# Altium project Carrier-Board-v1.0.PrjPcb (part 5 of 15)

## Sheet USB2.0_INTERFACE.SchDoc
size A4; SheetNumber: 10; SheetTotal: 27
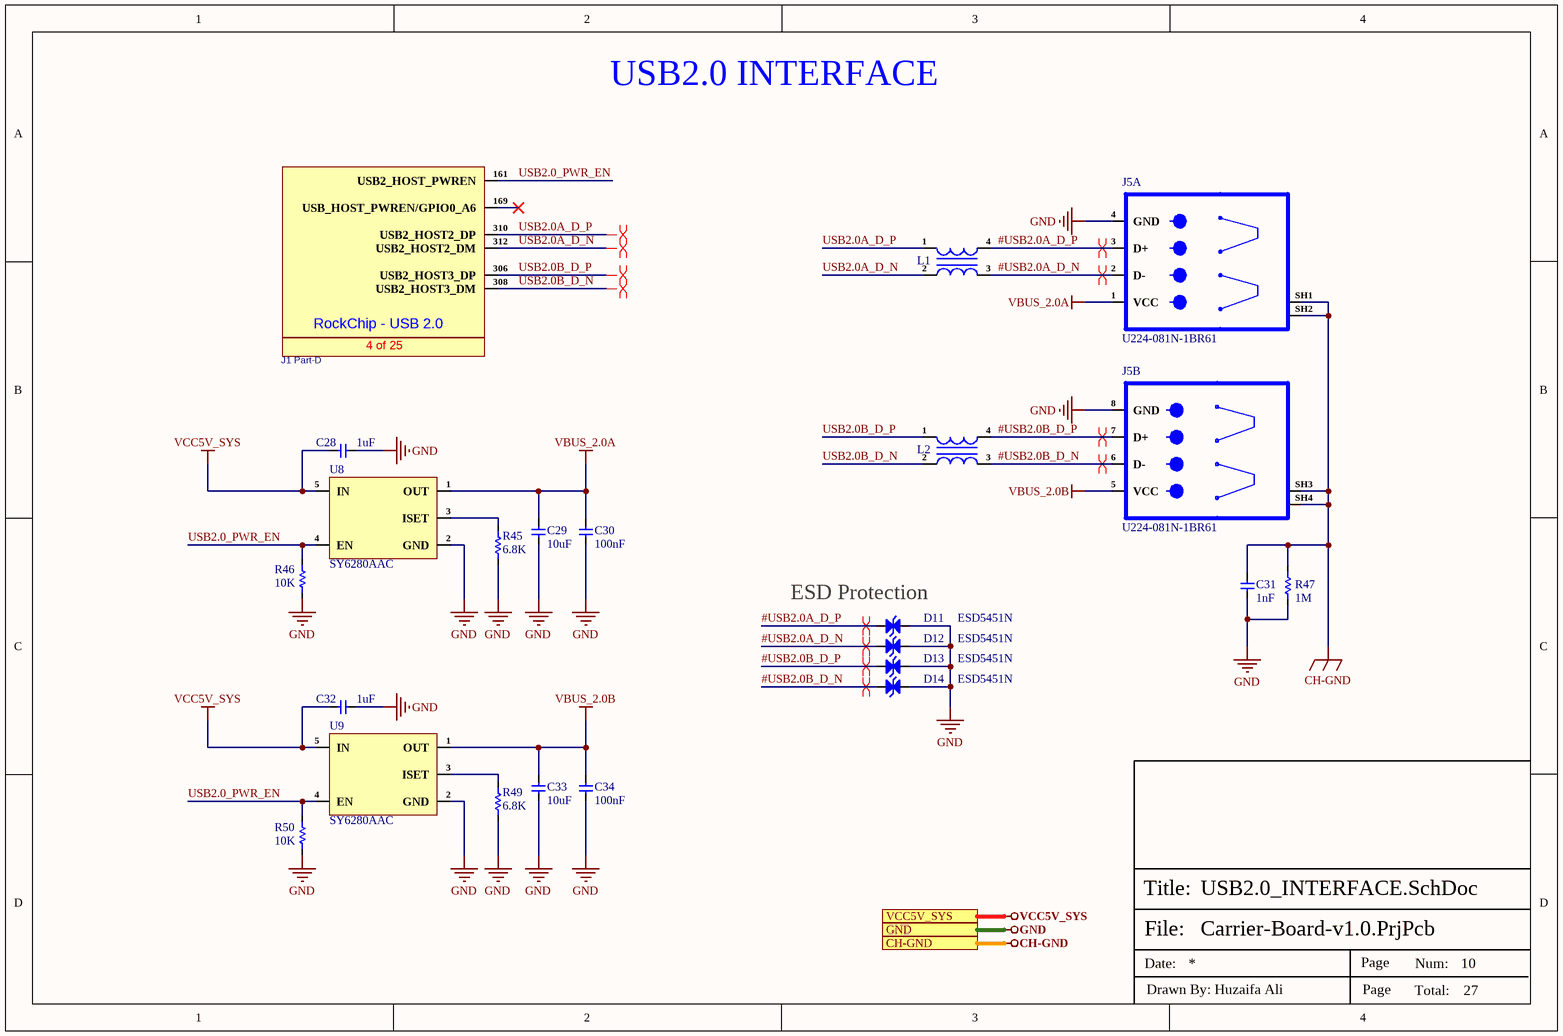
[diagram p9: USB2.0_INTERFACE.SchDoc]

### Parts
C28  1uF  [Cap-0402]
C29  10uF  [Cap-0603]
C30  100nF  [Cap-0402]
C31  1nF  [Cap-1206]
C32  1uF  [Cap-0402]
C33  10uF  [Cap-0603]
C34  100nF  [Cap-0402]
D11  ESD5451N  [DFN1006-2L (Bi-Directional)]
D12  ESD5451N  [DFN1006-2L (Bi-Directional)]
D13  ESD5451N  [DFN1006-2L (Bi-Directional)]
D14  ESD5451N  [DFN1006-2L (Bi-Directional)]
J1_Part-  AS0B826-S78B-7H  [AS0B826-S78B-7H]  (value not drawn)  (part D of 25)
J5  U224-081N-1BR61  [U224-081N-1BR61]  (parts A,B of 2)
L1  MCZ1210CH900L2TA0G  [MCZ1210CH900L2]  (value not drawn)
L2  MCZ1210CH900L2TA0G  [MCZ1210CH900L2]  (value not drawn)
R45  6.8K  [Res-0402]
R46  10K  [Res-0402]
R47  1M  [Res-0402]
R49  6.8K  [Res-0402]
R50  10K  [Res-0402]
U8  SY6280AAC  [SOT-23-5]
U9  SY6280AAC  [SOT-23-5]

### Ports
CH-GND (see TOP SHEET[2C], ETHERNET_PHY0[4D], ETHERNET_PHY1[4D], HDMI_INTERFACE[3D], MICRO_SD_INTERFACE[3D], USB3.0_INTERFACE[3D], USB-C_INTERFACE[2D]), GND (see TOP SHEET[2C], AUDIO_INTERFACE[1D], BUCK REGULATOR[3D], DEBUG_UART_INTERFACE[3D], DIGITAL IO_RELAY_SHEET[5D], DUAL_SIM_INTERFACE[3D], ETHERNET_PHY0[4D], ETHERNET_PHY1[4D], GSM_INTERFACE[2D], HDMI_INTERFACE[3D], INPUT_PROTECTION[3D], LINEAR_VOLTAGE_REG[3D], MICRO_SD_INTERFACE[3D], MIPI-DSI DISPLAY[3D], POWER SECTION[3D], PUSH BUTTONs_INTERFACE[3C], RGB_LEDs_INTERFACE[3D], ROCKCHIP_PWR_SUPPLY[1D], ROCKCHIP_SYSTEM_CONTROL[3C], RS232_RS485_INTERFACE[3C], SENSOR_SHEET[3D], USB3.0_INTERFACE[3D], USB-C_INTERFACE[2D], WIEGAND_INTERFACE[3D], WIFI_BLUETOOTH_SHEET[4C]), VCC5V_SYS (see TOP SHEET[2C], BUCK REGULATOR[3D], DIGITAL IO_RELAY_SHEET[5D], HDMI_INTERFACE[3D], LINEAR_VOLTAGE_REG[3D], MIPI-DSI DISPLAY[3D], POWER SECTION[3D], RGB_LEDs_INTERFACE[3D], ROCKCHIP_PWR_SUPPLY[1D], USB3.0_INTERFACE[3D], USB-C_INTERFACE[2D], WIEGAND_INTERFACE[3D])

### Nets
CH-GND: C31.2 J5.SH1(GND) J5.SH2(GND) J5.SH3(GND) J5.SH4(GND) R47.2 ; port CH-GND
GND: C28.1 C29.1 C30.1 C31.1 C32.1 C33.1 C34.1 D11.2(K) D12.2(K) D13.2(K) D14.2(K) J5.4(GND) J5.8(GND) R45.1 R46.1 R47.1 R49.1 R50.1 U8.2(GND) U9.2(GND) ; port GND
VBUS_2.0A: C29.2 C30.2 J5.1(VCC) U8.1(OUT)
VBUS_2.0B: C33.2 C34.2 J5.5(VCC) U9.1(OUT)
VCC5V_SYS: C28.2 C32.2 U8.5(IN) U9.5(IN) ; port VCC5V_SYS
#USB2.0A_D_N: D12.1(K) J5.2(D-) L1.3
#USB2.0A_D_P: D11.1(K) J5.3(D+) L1.4
#USB2.0B_D_N: D14.1(K) J5.6(D-) L2.3
#USB2.0B_D_P: D13.1(K) J5.7(D+) L2.4
USB2.0_PWR_EN: J1_Part-.161(USB2_HOST_PWREN) R46.2 R50.2 U8.4(EN) U9.4(EN)
USB2.0A_D_N: J1_Part-.312(USB2_HOST2_DM) L1.2
USB2.0A_D_P: J1_Part-.310(USB2_HOST2_DP) L1.1
USB2.0B_D_N: J1_Part-.308(USB2_HOST3_DM) L2.2
USB2.0B_D_P: J1_Part-.306(USB2_HOST3_DP) L2.1
NetR45_2: R45.2 U8.3(ISET)
NetR49_2: R49.2 U9.3(ISET)

Not connected (* = marked no-connect by the designer): J1_Part- 169(USB_HOST_PWREN/GPIO0_A6)*

### Layout directives
differential pair; differential pair class DIFF-USB-90; rule Matched Net Lengths [Tolerance = 0.508mm]; rule Impedance Constraint [Min = 85.00    Max = 95.00    ]: #USB2.0A_D_N, #USB2.0A_D_P, #USB2.0B_D_N, #USB2.0B_D_P, USB2.0A_D_N, USB2.0A_D_P, USB2.0B_D_N, USB2.0B_D_P

### Notes on the sheet
- USB2.0 INTERFACE
- (near D11) ESD Protection
- File:
- Title:
- Date:
- Page
- Num:
- Total:
- Drawn By: Huzaifa Ali
- (in symbol AS0B826-S78B-7H, part D) RockChip - USB 2.0; 4 of 25

### Library data of the parts
C28 C32 = CC0402KRX5R7BB105: CAP CER 1UF 16V X5R 0402; Manufacturer: Yageo; Tolerance: 10%; Item Type: Capacitor; Supplier 1: Digi-Key; Manufacturer Part Number: CC0402KRX5R7BB105; Stock 1: 1405667; Pricing 1: 1=0.36, 10=0.252, 100=0.1512, 500=0.1134, 1000=0.09576, 2500=0.09072, 5000=0.08568 (USD); Mount: Surface Mount; Case/Package: 0402; Weight: 2.3E-05oz; Case Code (Imperial): 0402; Case Code (Metric): 1005; Min Operating Temperature: -55°C; Max Operating Temperature: 85°C; Capacitance: 1uF; Dielectric: X5R; Packaging: Tape and Reel; Voltage Rating (DC): 16V; Voltage Rating: 16V; Termination: SMD/SMT; Composition: Ceramic; Length: 1mm; Height: 0.5mm; Width: 0.02inch; Thickness: 0.022inch; Depth: 0.5mm; Radiation Hardening: No; Lead Free: Lead Free; Halogen Free: Halogen Free; ComponentLink1URL: http://www.yageo.com/documents/recent/UPY-GPHC_X5R_4V-to-50V_12.pdf?src-supplier=Avnet+Europe; ComponentLink1Description: http://www.yageo.com/documents/recent/UPY-GPHC_X5R_4V-to-50V_12.pdf?src-supplier=Avnet+Europe; Supplier Part Number 1: 311-1691-6-ND; LCSC Part Number: C325464
C29 C33 = CC0603KRX5R7BB106: CAP CER 10UF 16V X5R 0603; Manufacturer: Yageo; Item Type: Capacitor; Tolerance: 10%; Manufacturer Part Number: CC0603KRX5R7BB106; LCSC Part Number: C2936601; ComponentLink1Description: http://www.yageo.com/documents/recent/UPY-GPHC_X5R_4V-to-50V_25.pdf?src-supplier=Digi-Key; ComponentLink1URL: http://www.yageo.com/documents/recent/UPY-GPHC_X5R_4V-to-50V_25.pdf?src-supplier=Digi-Key; Supplier 1: Digi-Key; RoHS: Yes; Category: Ceramic Capacitors; Stock 1: 240725; Pricing 1: 1=0.68000, 10=0.48000, 50=0.36300, 100=0.31610, 500=0.23416, 1000=0.19903 (USD); Mount: Surface Mount; Case/Package: 0603; Case Code (Imperial): 0603; Case Code (Metric): 1608; Min Operating Temperature: -55°C; Max Operating Temperature: 85°C; Packaging: Cut Tape; Capacitance: 10uF; Voltage Rating: 16V; RoHS Compliant: Yes; Supplier Part Number 1: 311-3486-1-ND
C30 C34 = CC0402KRX5R7BB104: CAP CER 0.1UF 16V X5R 0402; Manufacturer: Yageo; Tolerance: 10%; Supplier 1: Mouser; Manufacturer Part Number: CC0402KRX5R7BB104; RoHS: Yes; Category: Ceramic Capacitors; Stock 1: 936792; Pricing 1: 1=0.10000, 10=0.02300, 50=0.02300, 100=0.01100, 1000=0.00600, 10000=0.00400 (USD); Mount: Surface Mount; Case/Package: 0402; Case Code (Metric): 1005; Case Code (Imperial): 0402; Min Operating Temperature: -55°C; Max Operating Temperature: 85°C; Capacitance: 100nF; Packaging: Tape and Reel; Voltage Rating: 16V; Dielectric: X5R; Termination: SMD/SMT; Voltage Rating (DC): 16V; Package Quantity: 1; Series: CC; Length: 1mm; Width: 0.02inch; Height: 0.5mm; Thickness: 0.022inch; Lead Free: Lead Free; RoHS Compliant: Yes; ComponentLink1URL: https://datasheet.ciiva.com/155/mlccorderingcode-155879.pdf?src-supplier=Digi-Key; ComponentLink1Description: https://datasheet.ciiva.com/155/mlccorderingcode-155879.pdf?src-supplier=Digi-Key; ComponentLink2URL: https://datasheet.ciiva.com/155/mlccorderingcode-155878.pdf?src-supplier=Digi-Key; ComponentLink2Description: https://datasheet.ciiva.com/155/mlccorderingcode-155878.pdf?src-supplier=Digi-Key; ComponentLink3URL: https://datasheet.ciiva.com/155/mlccorderingcode-155880.pdf?src-supplier=Digi-Key; ComponentLink3Description: https://datasheet.ciiva.com/155/mlccorderingcode-155880.pdf?src-supplier=Digi-Key; ComponentLink4URL: https://datasheet.ciiva.com/11464/upy-gphc-x5r-4v-to-50v-12-11464869.pdf?src-supplier=Avnet; ComponentLink4Description: https://datasheet.ciiva.com/11464/upy-gphc-x5r-4v-to-50v-12-11464869.pdf?src-supplier=Avnet; Supplier Part Number 1: 603-CC402KRX5R7BB104; LCSC Part Number: C106204; Number of Pins: 2; Resistor Type: Ceramic; Construction: Flat; Depth: 0.5mm; Radiation Hardening: No; REACH SVHC: Unknown; Halogen Free: Halogen Free
C31 = CC1206KKX7RDBB102: CAP CER 1000PF 2KV X7R 1206; Manufacturer: Yageo; Tolerance: 10%; Dissipation Factor: 2.5%; Insulation Resistance: 10GR; Item Type: Capacitor; Manufacturer Part Number: CC1206KKX7RDBB102; RoHS: Yes; Category: Ceramic Capacitors; Case/Package: 1206; Case Code (Metric): 3216; Case Code (Imperial): 1206; Min Operating Temperature: -55°C; Max Operating Temperature: 125°C; Voltage Rating: 2kV; Packaging: Tape and Reel; Dielectric: X7R; Termination: SMD/SMT; Voltage Rating (DC): 2kV; Series: CC; Construction: Flat; Length: 3.2mm; RoHS Compliant: Yes; ComponentLink1URL: https://datasheet.ciiva.com/23942/1449957-23942422.pdf?src-supplier=Newark; ComponentLink1Description: https://datasheet.ciiva.com/23942/1449957-23942422.pdf?src-supplier=Newark; ComponentLink2URL: https://datasheet.ciiva.com/186/upy-np0x7r-hv-1kv-to-3kv-4-186736.pdf?src-supplier=Digi-Key; ComponentLink2Description: https://datasheet.ciiva.com/186/upy-np0x7r-hv-1kv-to-3kv-4-186736.pdf?src-supplier=Digi-Key; ComponentLink3URL: https://datasheet.ciiva.com/186/upy-np0x7r-hv-1kv-to-3kv-4-186737.pdf?src-supplier=Digi-Key; ComponentLink3Description: https://datasheet.ciiva.com/186/upy-np0x7r-hv-1kv-to-3kv-4-186737.pdf?src-supplier=Digi-Key; ComponentLink4URL: https://datasheet.ciiva.com/13386/upy-gp-np0-16v-to-50v-8-13386312.pdf?src-supplier=Mouser; ComponentLink4Description: https://datasheet.ciiva.com/13386/upy-gp-np0-16v-to-50v-8-13386312.pdf?src-supplier=Mouser; ComponentLink5URL: https://datasheet.ciiva.com/186/upy-np0x7r-hv-1kv-to-3kv-4-186735.pdf?src-supplier=Digi-Key; ComponentLink5Description: https://datasheet.ciiva.com/186/upy-np0x7r-hv-1kv-to-3kv-4-186735.pdf?src-supplier=Digi-Key; Supplier 1: Digi-Key; Stock 1: 19260; Pricing 1: 1=0.35000, 10=0.24000, 50=0.16780, 100=0.14390, 500=0.10794, 1000=0.09114 (USD); Mount: Surface Mount; Number of Pins: 2; Capacitance: 1nF; Voltage: 2kV; Package Quantity: 1; Resistor Type: Ceramic; Width: 0.063inch; Height: 1.25mm; Depth: 1.6mm; Thickness: 0.057inch; Radiation Hardening: No; REACH SVHC: Unknown; Lead Free: Lead Free; Supplier Part Number 1: 311-1487-1-ND; LCSC Part Number: C23631
D11-D14 = ESD5451N: DFN1006-2(0402) ESD Protection Devices ROHS; Manufacturer: TECH PUBLIC; Manufacturer Part Number: ESD5451N; Footprint: DFN1006-2(0402); ComponentLink1Description: LCSC; ComponentLink1URL: https://www.lcsc.com/product-detail/span-style-background-color-ff0-ESD-span-Protection-Devices_TECH-PUBLIC-ESD5451N_C2936977.html; LCSC Part Number: C2936977
J1_Part- = AS0B826-S78B-7H: SMD,P=0.5mm,Surface Mount，Right Angle; Manufacturer: FOXCONN; Item Type: Card Edge Connectors; Supplier: LCSC; Manufacturer Part Number: AS0B826-S78B-7H; RoHS: No; Stock: 4979; Pricing: 1=9.21, 10=8.287, 25=7.8064, 50=7.6064, 100=7.4062 (USD); LCSC Part Number: C426232
J5 = U224-081N-1BR61: USB 2.0 1.5A 2 235℃ Right-Angle 4P+4P Female -40℃~+85℃ Gold Brass Type-A Plugin USB Connectors ROHS; Manufacturer: XKB Connection; Item Type: Type-A USB Connector; Manufacturer Part Number: U224-081N-1BR61; Package: Plugin; LCSC Part Number: C908455; ComponentLink1Description: LCSC; ComponentLink1URL: https://www.lcsc.com/product-detail/USB-Connectors_XKB-Connection-U224-081N-1BR61_C908455.html
L1 L2 = MCZ1210CH900L2TA0G: CMC 100MA 2LN 90 OHM SMD; Manufacturer: TDK; Item Type: Common Mode Chokes; Supplier: Digikey; Supplier Part Number: 445-MCZ1210CH900L2CT-ND; Manufacturer Part Number: MCZ1210CH900L2TA0G; RoHS: Yes; Stock: 26958; Pricing: 1=0.54, 10=0.464, 25=0.4248, 50=0.3862, 100=0.3438, 250=0.32444, 500=0.2781, 1000=0.2472 (USD); LCSC Part Number: C307688
R45 R49 = RC0402FR-076K8L: RES 6.8K OHM 1% 1/16W 0402; Manufacturer: Yageo; Resistance: 6.8kR; Power Rating: 63mW; Voltage Rating: 50V; Temperature Coefficient: 100ppm/°C; Item Type: Resistor; Supplier 1: Avnet; Manufacturer Part Number: RC0402FR-076K8L; RoHS: Yes; Category: Chip SMD Resistors; Stock 1: 290000; Pricing 1: 10000=0.00085 (USD); Case/Package: 0402; Number of Pins: 2; Case Code (Imperial): 0402; Case Code (Metric): 1005; Size Code: 0402; Min Operating Temperature: -55°C; Max Operating Temperature: 155°C; Packaging: Tape and Reel; Tolerance: 1%; Voltage Rating (DC): 50V; Package Quantity: 1; Termination: SMD/SMT; Resistor Type: Thick Film; Number of Terminations: 2; Max Power Dissipation: 63mW; Features: Moisture Resistant; Series: RC; Construction: Rectangular; Resistance Tolerance: 1%; Technology: THICK FILM; Length: 0.039inch; Width: 0.02inch; Height: 0.016inch; Depth: 0.5mm; Reach SVHC Compliant: Yes; Military Standard: Not; Lead Free: Lead Free; RoHS Compliant: Yes; ComponentLink1URL: https://datasheet.ciiva.com/11819/0900766b80c66297-11819535.pdf?src-supplier=RSComponents; ComponentLink1Description: https://datasheet.ciiva.com/11819/0900766b80c66297-11819535.pdf?src-supplier=RSComponents; ComponentLink2URL: https://datasheet.ciiva.com/2453/pyu-r-int-thick-7-2453500.pdf?src-supplier=Digi-Key; ComponentLink2Description: https://datasheet.ciiva.com/2453/pyu-r-int-thick-7-2453500.pdf?src-supplier=Digi-Key; ComponentLink3URL: https://datasheet.ciiva.com/2453/pyu-r-int-thick-7-2453501.pdf?src-supplier=Digi-Key; ComponentLink3Description: https://datasheet.ciiva.com/2453/pyu-r-int-thick-7-2453501.pdf?src-supplier=Digi-Key; ComponentLink4URL: https://datasheet.ciiva.com/2453/pyu-r-int-thick-7-2453499.pdf?src-supplier=Digi-Key; ComponentLink4Description: https://datasheet.ciiva.com/2453/pyu-r-int-thick-7-2453499.pdf?src-supplier=Digi-Key; ComponentLink5URL: https://datasheet.ciiva.com/12668/pyu-rc0402-51-rohs-l-6-r-12668201.pdf?src-supplier=Mouser; ComponentLink5Description: https://datasheet.ciiva.com/12668/pyu-rc0402-51-rohs-l-6-r-12668201.pdf?src-supplier=Mouser; ComponentLink6URL: https://datasheet.ciiva.com/7850/1018594-7850078.pdf?src-supplier=Element14; ComponentLink6Description: https://datasheet.ciiva.com/7850/1018594-7850078.pdf?src-supplier=Element14; ComponentLink7URL: https://datasheet.ciiva.com/7850/1018594-7850079.pdf?src-supplier=Element14; ComponentLink7Description: https://datasheet.ciiva.com/7850/1018594-7850079.pdf?src-supplier=Element14; ComponentLink8URL: https://datasheet.ciiva.com/16741/pyu-rc0402-51-rohs-l-6-r-16741018.pdf?src-supplier=Future+Electronics; ComponentLink8Description: https://datasheet.ciiva.com/16741/pyu-rc0402-51-rohs-l-6-r-16741018.pdf?src-supplier=Future+Electronics; Supplier Part Number 1: RC0402FR-076K8L; LCSC Part Number: C93940
R46 R50 = RC0402FR-0710KL: RES 10K OHM 1% 1/16W 0402; Manufacturer: Yageo; Max Power Dissipation: 63mW; Temperature Coefficient: 100ppm/°C; Resistance: 10kR; Voltage Rating (DC): 50V; Power Rating: 62.5mW; Item Type: Resistor; Manufacturer Part Number: RC0402FR-0710KL; RoHS: Yes; Category: Chip SMD Resistors; Case/Package: 0402; Case Code (Imperial): 0402; Case Code (Metric): 1005; Min Operating Temperature: -55°C; Max Operating Temperature: 155°C; Features: Moisture Resistant; Packaging: Tape and Reel; Tolerance: 1%; Number of Terminations: 2; Series: RC; RoHS Compliant: Yes; ComponentLink1URL: https://datasheet.ciiva.com/7660/38568-7660787.pdf?src-supplier=Element14; ComponentLink1Description: https://datasheet.ciiva.com/7660/38568-7660787.pdf?src-supplier=Element14; Supplier 1: Mouser; Stock 1: 18648329; Pricing 1: 1=0.10000, 10=0.01400, 50=0.01400, 100=0.00500, 1000=0.00300, 10000=0.00200 (USD); Number of Pins: 2; Resistor Type: Thick Film; Voltage Rating: 50V; Termination: SMD/SMT; Resistance Tolerance: 1%; Construction: Rectangular; Length: 1mm; Width: 0.5mm; Height: 0.32mm; Depth: 0.5mm; Lead Pitch: 0.2mm; REACH SVHC: No SVHC; Lead Free: Lead Free; Military Standard: Not; ComponentLink2URL: https://datasheet.ciiva.com/7849/1686128-7849814.pdf?src-supplier=Element14; ComponentLink2Description: https://datasheet.ciiva.com/7849/1686128-7849814.pdf?src-supplier=Element14; ComponentLink3URL: https://datasheet.ciiva.com/7983/1018594-7983486.pdf?src-supplier=Element14; ComponentLink3Description: https://datasheet.ciiva.com/7983/1018594-7983486.pdf?src-supplier=Element14; ComponentLink4URL: https://datasheet.ciiva.com/22747/1018594-22747512.pdf?src-supplier=Element14; ComponentLink4Description: https://datasheet.ciiva.com/22747/1018594-22747512.pdf?src-supplier=Element14; ComponentLink5URL: https://datasheet.ciiva.com/12667/pyu-rc0402-51-rohs-l-6-r-12667067.pdf?src-supplier=Mouser; ComponentLink5Description: https://datasheet.ciiva.com/12667/pyu-rc0402-51-rohs-l-6-r-12667067.pdf?src-supplier=Mouser; ComponentLink6URL: https://datasheet.ciiva.com/7849/1784430-7849813.pdf?src-supplier=Element14; ComponentLink6Description: https://datasheet.ciiva.com/7849/1784430-7849813.pdf?src-supplier=Element14; Supplier Part Number 1: 603-RC0402FR-0710KL; LCSC Part Number: C60490; Working Voltage: 50V; ComponentLink7URL: https://datasheet.ciiva.com/7849/1784430-7849815.pdf?src-supplier=Element14; ComponentLink7Description: https://datasheet.ciiva.com/7849/1784430-7849815.pdf?src-supplier=Element14
R47 = AF0402JR-071ML: RES SMD 1M OHM 5% 1/16W 0402; Manufacturer: Yageo; Temperature Coefficient: 100ppm/°C; Resistance: 1MR; Item Type: Resistor; Max Power Dissipation: 63mW; Manufacturer Part Number: AF0402JR-071ML; Case/Package: 0402; Min Operating Temperature: -55°C; Max Operating Temperature: 155°C; Packaging: Tape and Reel; Tolerance: 5%; Height: 0.015inch; ComponentLink1URL: https://www.yageo.com/upload/media/product/productsearch/datasheet/rchip/PYu-AF_51_RoHS_L_6.pdf?src-supplier=Digi-Key; ComponentLink1Description: https://www.yageo.com/upload/media/product/productsearch/datasheet/rchip/PYu-AF_51_RoHS_L_6.pdf?src-supplier=Digi-Key; Supplier 1: Digi-Key; Stock 1: 0; Pricing 1: 10000=0.00408 (USD); Length: 0.039inch; Width: 0.02inch; Supplier Part Number 1: AF0402JR-071ML-ND; LCSC Part Number: C144054; Resistor Type: Thick Film; Number of Terminations: 2; Features: Moisture Resistant,Anti-Sulfur; RoHS Compliant: Yes
U8 U9 = SY6280AAC: SOT-23-5 Power Distribution Switches ROHS; Manufacturer: Silergy; Item Type: IC; Supplier: Avnet; Supplier Part Number: SY6280AAC; Manufacturer Part Number: SY6280AAC; RoHS: No; Category: USB Interface ICs; Stock: 3000; LCSC Part Number: C55136

## Sheet USB3.0_INTERFACE.SchDoc
size A4; SheetNumber: 11; SheetTotal: 27
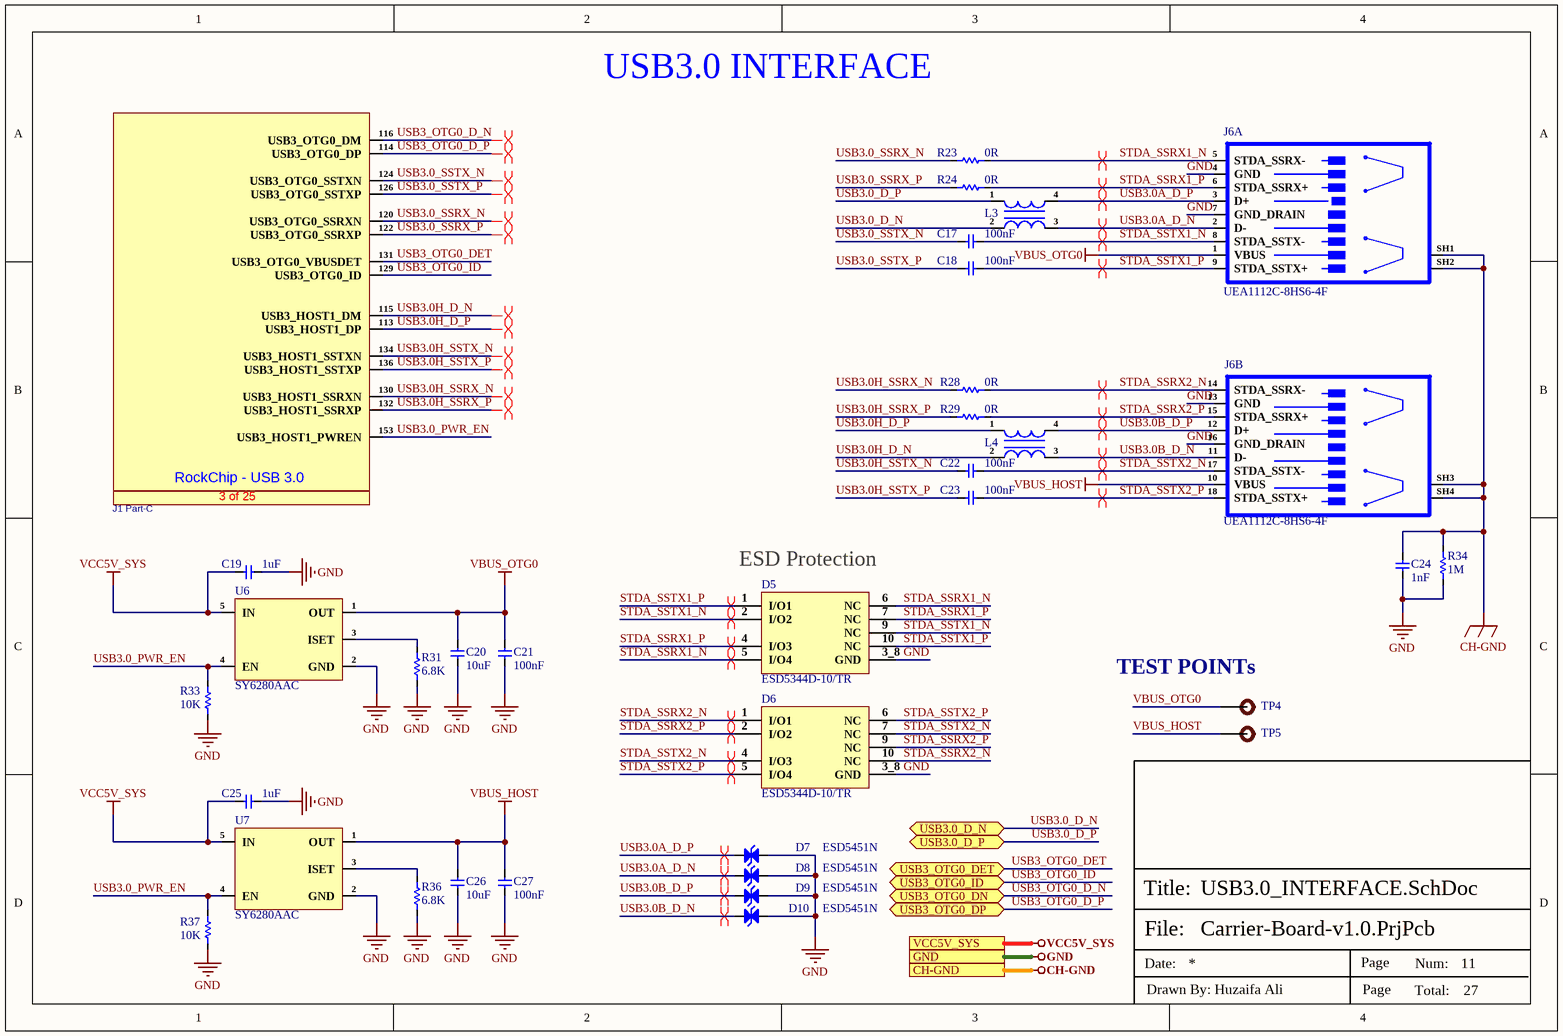
[diagram p10: USB3.0_INTERFACE.SchDoc]

### Parts
C17  100nF  [Cap-0402]
C18  100nF  [Cap-0402]
C19  1uF  [Cap-0402]
C20  10uF  [Cap-0603]
C21  100nF  [Cap-0402]
C22  100nF  [Cap-0402]
C23  100nF  [Cap-0402]
C24  1nF  [Cap-1206]
C25  1uF  [Cap-0402]
C26  10uF  [Cap-0603]
C27  100nF  [Cap-0402]
D5  ESD5344D-10/TR  [DFN2510-10L_]
D6  ESD5344D-10/TR  [DFN2510-10L_]
D7  ESD5451N  [DFN1006-2L (Bi-Directional)]
D8  ESD5451N  [DFN1006-2L (Bi-Directional)]
D9  ESD5451N  [DFN1006-2L (Bi-Directional)]
D10  ESD5451N  [DFN1006-2L (Bi-Directional)]
J1_Part-  AS0B826-S78B-7H  [AS0B826-S78B-7H]  (value not drawn)  (part C of 25)
J6  UEA1112C-8HS6-4F  [UEA1112C-8HS6-4F]  (parts A,B of 2)
L3  MCZ1210CH900L2TA0G  [MCZ1210CH900L2]  (value not drawn)
L4  MCZ1210CH900L2TA0G  [MCZ1210CH900L2]  (value not drawn)
R23  0R  [Res-0402]
R24  0R  [Res-0402]
R28  0R  [Res-0402]
R29  0R  [Res-0402]
R31  6.8K  [Res-0402]
R33  10K  [Res-0402]
R34  1M  [Res-0402]
R36  6.8K  [Res-0402]
R37  10K  [Res-0402]
TP4  TEST POINT 0.5mm Dia  [Test-point - 0.5mm]  (value not drawn)  (no BOM)
TP5  TEST POINT 0.5mm Dia  [Test-point - 0.5mm]  (value not drawn)  (no BOM)
U6  SY6280AAC  [SOT-23-5]
U7  SY6280AAC  [SOT-23-5]

### Ports
CH-GND (see TOP SHEET[2C], ETHERNET_PHY0[4D], ETHERNET_PHY1[4D], HDMI_INTERFACE[3D], MICRO_SD_INTERFACE[3D], USB2.0_INTERFACE[3D], USB-C_INTERFACE[2D]), GND (see TOP SHEET[2C], AUDIO_INTERFACE[1D], BUCK REGULATOR[3D], DEBUG_UART_INTERFACE[3D], DIGITAL IO_RELAY_SHEET[5D], DUAL_SIM_INTERFACE[3D], ETHERNET_PHY0[4D], ETHERNET_PHY1[4D], GSM_INTERFACE[2D], HDMI_INTERFACE[3D], INPUT_PROTECTION[3D], LINEAR_VOLTAGE_REG[3D], MICRO_SD_INTERFACE[3D], MIPI-DSI DISPLAY[3D], POWER SECTION[3D], PUSH BUTTONs_INTERFACE[3C], RGB_LEDs_INTERFACE[3D], ROCKCHIP_PWR_SUPPLY[1D], ROCKCHIP_SYSTEM_CONTROL[3C], RS232_RS485_INTERFACE[3C], SENSOR_SHEET[3D], USB2.0_INTERFACE[3D], USB-C_INTERFACE[2D], WIEGAND_INTERFACE[3D], WIFI_BLUETOOTH_SHEET[4C]), USB3.0_D_N (bidir, see TOP SHEET[2C], USB-C_INTERFACE[3D]), USB3.0_D_P (bidir, see TOP SHEET[2C], USB-C_INTERFACE[3D]), USB3_OTG0_DET (bidir, see TOP SHEET[2C], USB-C_INTERFACE[3D]), USB3_OTG0_DN (bidir, see TOP SHEET[2C], USB-C_INTERFACE[3D]), USB3_OTG0_DP (bidir, see TOP SHEET[2C], USB-C_INTERFACE[3D]), USB3_OTG0_ID (bidir, see TOP SHEET[2C], USB-C_INTERFACE[3D]), VCC5V_SYS (see TOP SHEET[2C], BUCK REGULATOR[3D], DIGITAL IO_RELAY_SHEET[5D], HDMI_INTERFACE[3D], LINEAR_VOLTAGE_REG[3D], MIPI-DSI DISPLAY[3D], POWER SECTION[3D], RGB_LEDs_INTERFACE[3D], ROCKCHIP_PWR_SUPPLY[1D], USB2.0_INTERFACE[3D], USB-C_INTERFACE[2D], WIEGAND_INTERFACE[3D])

### Nets
CH-GND: C24.2 J6.SH1(GND) J6.SH2(GND) J6.SH3(GND) J6.SH4(GND) R34.2 ; port CH-GND
GND: C19.1 C20.1 C21.1 C24.1 C25.1 C26.1 C27.1 D5.3_8(GND) D6.3_8(GND) D7.1(K) D8.1(K) D9.1(K) D10.1(K) J6.4(GND) J6.7(GND_DRAIN) J6.13(GND) J6.16(GND_DRAIN) R31.1 R33.1 R34.1 R36.1 R37.1 U6.2(GND) U7.2(GND) ; port GND
VBUS_HOST: C26.2 C27.2 J6.10(VBUS) TP5.1 U7.1(OUT)
VBUS_OTG0: C20.2 C21.2 J6.1(VBUS) TP4.1 U6.1(OUT)
VCC5V_SYS: C19.2 C25.2 U6.5(IN) U7.5(IN) ; port VCC5V_SYS
STDA_SSRX1_N: D5.5(I/O4) D5.6(NC) J6.5(STDA_SSRX-) R23.2
STDA_SSRX1_P: D5.4(I/O3) D5.7(NC) J6.6(STDA_SSRX+) R24.2
STDA_SSRX2_N: D6.1(I/O1) D6.10(NC) J6.14(STDA_SSRX-) R28.2
STDA_SSRX2_P: D6.2(I/O2) D6.9(NC) J6.15(STDA_SSRX+) R29.2
STDA_SSTX1_N: C17.1 D5.2(I/O2) D5.9(NC) J6.8(STDA_SSTX-)
STDA_SSTX1_P: C18.1 D5.1(I/O1) D5.10(NC) J6.9(STDA_SSTX+)
STDA_SSTX2_N: C22.1 D6.4(I/O3) D6.7(NC) J6.17(STDA_SSTX-)
STDA_SSTX2_P: C23.1 D6.5(I/O4) D6.6(NC) J6.18(STDA_SSTX+)
USB3.0_D_N: L3.2 ; port USB3.0_D_N
USB3.0_D_P: L3.1 ; port USB3.0_D_P
USB3.0_PWR_EN: J1_Part-.153(USB3_HOST1_PWREN) R33.2 R37.2 U6.4(EN) U7.4(EN)
USB3.0_SSRX_N: J1_Part-.120(USB3_OTG0_SSRXN) R23.1
USB3.0_SSRX_P: J1_Part-.122(USB3_OTG0_SSRXP) R24.1
USB3.0_SSTX_N: C17.2 J1_Part-.124(USB3_OTG0_SSTXN)
USB3.0_SSTX_P: C18.2 J1_Part-.126(USB3_OTG0_SSTXP)
USB3.0A_D_N: D8.2(K) J6.2(D-) L3.3
USB3.0A_D_P: D7.2(K) J6.3(D+) L3.4
USB3.0B_D_N: D10.2(K) J6.11(D-) L4.3
USB3.0B_D_P: D9.2(K) J6.12(D+) L4.4
USB3.0H_D_N: J1_Part-.115(USB3_HOST1_DM) L4.2
USB3.0H_D_P: J1_Part-.113(USB3_HOST1_DP) L4.1
USB3.0H_SSRX_N: J1_Part-.130(USB3_HOST1_SSRXN) R28.1
USB3.0H_SSRX_P: J1_Part-.132(USB3_HOST1_SSRXP) R29.1
USB3.0H_SSTX_N: C22.2 J1_Part-.134(USB3_HOST1_SSTXN)
USB3.0H_SSTX_P: C23.2 J1_Part-.136(USB3_HOST1_SSTXP)
USB3_OTG0_D_N: J1_Part-.116(USB3_OTG0_DM) ; port USB3_OTG0_DN
USB3_OTG0_D_P: J1_Part-.114(USB3_OTG0_DP) ; port USB3_OTG0_DP
USB3_OTG0_DET: J1_Part-.131(USB3_OTG0_VBUSDET) ; port USB3_OTG0_DET
USB3_OTG0_ID: J1_Part-.129(USB3_OTG0_ID) ; port USB3_OTG0_ID
NetR31_2: R31.2 U6.3(ISET)
NetR36_2: R36.2 U7.3(ISET)

### Layout directives
differential pair; differential pair class DIFF-USB-90; rule Matched Net Lengths [Tolerance = 0.508mm]; rule Impedance Constraint [Min = 85.00    Max = 95.00    ]: STDA_SSRX1_N, STDA_SSRX1_P, STDA_SSRX2_N, STDA_SSRX2_P, STDA_SSTX1_N, STDA_SSTX1_P, STDA_SSTX2_N, STDA_SSTX2_P, USB3.0_SSRX_N, USB3.0_SSRX_P, USB3.0_SSTX_N, USB3.0_SSTX_P, USB3.0A_D_N, USB3.0A_D_P, USB3.0B_D_N, USB3.0B_D_P, USB3.0H_D_N, USB3.0H_D_P, USB3.0H_SSRX_N, USB3.0H_SSRX_P, USB3.0H_SSTX_N, USB3.0H_SSTX_P, USB3_OTG0_D_N, USB3_OTG0_D_P

### Notes on the sheet
- USB3.0 INTERFACE
- (near D5) ESD Protection
- (near TP4) TEST POINTs
- File:
- Title:
- Date:
- Page
- Num:
- Total:
- Drawn By: Huzaifa Ali
- (in symbol AS0B826-S78B-7H, part C) RockChip - USB 3.0; 3 of 25

### Library data of the parts
C17 C18 C21-C23 C27 = CC0402KRX5R7BB104: as C30 on sheet USB2.0_INTERFACE; Supplier 1: Mouser; Manufacturer Part Number: CC0402KRX5R7BB104; RoHS: Yes; Category: Ceramic Capacitors; Stock 1: 936792; Pricing 1: 1=0.10000, 10=0.02300, 50=0.02300, 100=0.01100, 1000=0.00600, 10000=0.00400 (USD); Mount: Surface Mount; Case/Package: 0402; Case Code (Metric): 1005; Case Code (Imperial): 0402; Min Operating Temperature: -55°C; Max Operating Temperature: 85°C; Capacitance: 100nF; Packaging: Tape and Reel; Voltage Rating: 16V; Dielectric: X5R; Termination: SMD/SMT; Voltage Rating (DC): 16V; Package Quantity: 1; Series: CC; Length: 1mm; Width: 0.02inch; Height: 0.5mm; Thickness: 0.022inch; Lead Free: Lead Free; RoHS Compliant: Yes; ComponentLink1URL: https://datasheet.ciiva.com/155/mlccorderingcode-155879.pdf?src-supplier=Digi-Key; ComponentLink1Description: https://datasheet.ciiva.com/155/mlccorderingcode-155879.pdf?src-supplier=Digi-Key; ComponentLink2URL: https://datasheet.ciiva.com/155/mlccorderingcode-155878.pdf?src-supplier=Digi-Key; ComponentLink2Description: https://datasheet.ciiva.com/155/mlccorderingcode-155878.pdf?src-supplier=Digi-Key; ComponentLink3URL: https://datasheet.ciiva.com/155/mlccorderingcode-155880.pdf?src-supplier=Digi-Key; ComponentLink3Description: https://datasheet.ciiva.com/155/mlccorderingcode-155880.pdf?src-supplier=Digi-Key; ComponentLink4URL: https://datasheet.ciiva.com/11464/upy-gphc-x5r-4v-to-50v-12-11464869.pdf?src-supplier=Avnet; ComponentLink4Description: https://datasheet.ciiva.com/11464/upy-gphc-x5r-4v-to-50v-12-11464869.pdf?src-supplier=Avnet; Supplier Part Number 1: 603-CC402KRX5R7BB104; LCSC Part Number: C106204; Number of Pins: 2; Resistor Type: Ceramic; Construction: Flat; Depth: 0.5mm; Radiation Hardening: No; REACH SVHC: Unknown; Halogen Free: Halogen Free
C19 C25 = CC0402KRX5R7BB105: as C28 on sheet USB2.0_INTERFACE; Supplier 1: Digi-Key; Manufacturer Part Number: CC0402KRX5R7BB105; Stock 1: 1405667; Pricing 1: 1=0.36, 10=0.252, 100=0.1512, 500=0.1134, 1000=0.09576, 2500=0.09072, 5000=0.08568 (USD); Mount: Surface Mount; Case/Package: 0402; Weight: 2.3E-05oz; Case Code (Imperial): 0402; Case Code (Metric): 1005; Min Operating Temperature: -55°C; Max Operating Temperature: 85°C; Capacitance: 1uF; Dielectric: X5R; Packaging: Tape and Reel; Voltage Rating (DC): 16V; Voltage Rating: 16V; Termination: SMD/SMT; Composition: Ceramic; Length: 1mm; Height: 0.5mm; Width: 0.02inch; Thickness: 0.022inch; Depth: 0.5mm; Radiation Hardening: No; Lead Free: Lead Free; Halogen Free: Halogen Free; ComponentLink1URL: http://www.yageo.com/documents/recent/UPY-GPHC_X5R_4V-to-50V_12.pdf?src-supplier=Avnet+Europe; ComponentLink1Description: http://www.yageo.com/documents/recent/UPY-GPHC_X5R_4V-to-50V_12.pdf?src-supplier=Avnet+Europe; Supplier Part Number 1: 311-1691-6-ND; LCSC Part Number: C325464
C20 C26 = CC0603KRX5R7BB106: as C29 on sheet USB2.0_INTERFACE; Manufacturer Part Number: CC0603KRX5R7BB106; LCSC Part Number: C2936601; ComponentLink1Description: http://www.yageo.com/documents/recent/UPY-GPHC_X5R_4V-to-50V_25.pdf?src-supplier=Digi-Key; ComponentLink1URL: http://www.yageo.com/documents/recent/UPY-GPHC_X5R_4V-to-50V_25.pdf?src-supplier=Digi-Key; Supplier 1: Digi-Key; RoHS: Yes; Category: Ceramic Capacitors; Stock 1: 240725; Pricing 1: 1=0.68000, 10=0.48000, 50=0.36300, 100=0.31610, 500=0.23416, 1000=0.19903 (USD); Mount: Surface Mount; Case/Package: 0603; Case Code (Imperial): 0603; Case Code (Metric): 1608; Min Operating Temperature: -55°C; Max Operating Temperature: 85°C; Packaging: Cut Tape; Capacitance: 10uF; Voltage Rating: 16V; RoHS Compliant: Yes; Supplier Part Number 1: 311-3486-1-ND
C24 = CC1206KKX7RDBB102: as C31 on sheet USB2.0_INTERFACE; Manufacturer Part Number: CC1206KKX7RDBB102; RoHS: Yes; Category: Ceramic Capacitors; Case/Package: 1206; Case Code (Metric): 3216; Case Code (Imperial): 1206; Min Operating Temperature: -55°C; Max Operating Temperature: 125°C; Voltage Rating: 2kV; Packaging: Tape and Reel; Dielectric: X7R; Termination: SMD/SMT; Voltage Rating (DC): 2kV; Series: CC; Construction: Flat; Length: 3.2mm; RoHS Compliant: Yes; ComponentLink1URL: https://datasheet.ciiva.com/23942/1449957-23942422.pdf?src-supplier=Newark; ComponentLink1Description: https://datasheet.ciiva.com/23942/1449957-23942422.pdf?src-supplier=Newark; ComponentLink2URL: https://datasheet.ciiva.com/186/upy-np0x7r-hv-1kv-to-3kv-4-186736.pdf?src-supplier=Digi-Key; ComponentLink2Description: https://datasheet.ciiva.com/186/upy-np0x7r-hv-1kv-to-3kv-4-186736.pdf?src-supplier=Digi-Key; ComponentLink3URL: https://datasheet.ciiva.com/186/upy-np0x7r-hv-1kv-to-3kv-4-186737.pdf?src-supplier=Digi-Key; ComponentLink3Description: https://datasheet.ciiva.com/186/upy-np0x7r-hv-1kv-to-3kv-4-186737.pdf?src-supplier=Digi-Key; ComponentLink4URL: https://datasheet.ciiva.com/13386/upy-gp-np0-16v-to-50v-8-13386312.pdf?src-supplier=Mouser; ComponentLink4Description: https://datasheet.ciiva.com/13386/upy-gp-np0-16v-to-50v-8-13386312.pdf?src-supplier=Mouser; ComponentLink5URL: https://datasheet.ciiva.com/186/upy-np0x7r-hv-1kv-to-3kv-4-186735.pdf?src-supplier=Digi-Key; ComponentLink5Description: https://datasheet.ciiva.com/186/upy-np0x7r-hv-1kv-to-3kv-4-186735.pdf?src-supplier=Digi-Key; Supplier 1: Digi-Key; Stock 1: 19260; Pricing 1: 1=0.35000, 10=0.24000, 50=0.16780, 100=0.14390, 500=0.10794, 1000=0.09114 (USD); Mount: Surface Mount; Number of Pins: 2; Capacitance: 1nF; Voltage: 2kV; Package Quantity: 1; Resistor Type: Ceramic; Width: 0.063inch; Height: 1.25mm; Depth: 1.6mm; Thickness: 0.057inch; Radiation Hardening: No; REACH SVHC: Unknown; Lead Free: Lead Free; Supplier Part Number 1: 311-1487-1-ND; LCSC Part Number: C23631
D5 D6 = ESD5344D-10/TR: DFN2510-10L ESD Protection Devices ROHS; Manufacturer: WILLSEMI; ComponentLink1Description: LCSC; ComponentLink1URL: https://www.lcsc.com/product-detail/span-style-background-color-ff0-ESD-span-Protection-Devices_WILLSEMI-Will-Semicon-ESD5344D-10-TR_C239666.html; Manufacturer Part Number: ESD5344D-10/TR; Footprint: DFN2510-10L; LCSC Part Number: C239666
D7-D10 = ESD5451N: as D11 on sheet USB2.0_INTERFACE; Manufacturer Part Number: ESD5451N; Footprint: DFN1006-2(0402); ComponentLink1Description: LCSC; ComponentLink1URL: https://www.lcsc.com/product-detail/span-style-background-color-ff0-ESD-span-Protection-Devices_TECH-PUBLIC-ESD5451N_C2936977.html; LCSC Part Number: C2936977
J1_Part- = AS0B826-S78B-7H: as J1_Part on sheet USB2.0_INTERFACE; Supplier: LCSC; Manufacturer Part Number: AS0B826-S78B-7H; RoHS: No; Stock: 4979; Pricing: 1=9.21, 10=8.287, 25=7.8064, 50=7.6064, 100=7.4062 (USD); LCSC Part Number: C426232
J6 = UEA1112C-8HS6-4F: USB 3.0 2 Right-Angle 9P+9P Female Type-A Plugin USB Connectors ROHS; Manufacturer: FOXCONN; Item Type: Type-A Connector; Manufacturer Part Number: UEA1112C-8HS6-4F; Package: Plugin; LCSC Part Number: C225759; ComponentLink1Description: LCSC; ComponentLink1URL: https://www.lcsc.com/product-detail/USB-Connectors_FOXCONN-UEA1112C-8HS6-4F_C225759.html
L3 L4 = MCZ1210CH900L2TA0G: as L1 on sheet USB2.0_INTERFACE; Supplier: Digikey; Supplier Part Number: 445-MCZ1210CH900L2CT-ND; Manufacturer Part Number: MCZ1210CH900L2TA0G; RoHS: Yes; Stock: 26958; Pricing: 1=0.54, 10=0.464, 25=0.4248, 50=0.3862, 100=0.3438, 250=0.32444, 500=0.2781, 1000=0.2472 (USD); LCSC Part Number: C307688
R23 R24 R28 R29 = RC0402FR-070RL: RES 0 OHM JUMPER 1/16W 0402; Manufacturer: Yageo; Tolerance: 1%; Power Rating: 62.5mW; Voltage Rating: 50V; Temperature Coefficient: 200ppm/°C; Max Power Dissipation: 63mW; Supplier 1: Mouser; Manufacturer Part Number: RC0402FR-070RL; RoHS: Yes; Category: Chip SMD Resistors; Stock 1: 8556842; Pricing 1: 1=0.10000, 10=0.01400, 50=0.01400, 100=0.00600, 1000=0.00300, 5000=0.00200, 10000=0.00100 (USD); Mount: Surface Mount; Case/Package: 0402; Contact Plating: Tin,Matte; Case Code (Imperial): 0402; Case Code (Metric): 1005; Size Code: 0402; Min Operating Temperature: -55°C; Max Operating Temperature: 155°C; Resistance: 0R; Resistor Type: Thick Film; Packaging: Tape and Reel; Termination: SMD/SMT; Features: Moisture Resistant; Series: RC; Number of Terminations: 2; Length: 1mm; Width: 0.5mm; Height: 0.35mm; Radiation Hardening: No; Lead Free: Lead Free; RoHS Compliant: Yes; ComponentLink1URL: https://datasheet.ciiva.com/8896/pyu-rc0402-51-rohs-l-6-8896149.pdf?src-supplier=Avnet; ComponentLink1Description: https://datasheet.ciiva.com/8896/pyu-rc0402-51-rohs-l-6-8896149.pdf?src-supplier=Avnet; ComponentLink2URL: https://datasheet.ciiva.com/16790/pyu-rc0402-51-rohs-l-6-r-16790444.pdf?src-supplier=Future+Electronics; ComponentLink2Description: https://datasheet.ciiva.com/16790/pyu-rc0402-51-rohs-l-6-r-16790444.pdf?src-supplier=Future+Electronics; Supplier Part Number 1: 603-RC0402FR-070RL; LCSC Part Number: C106231
R31 R36 = RC0402FR-076K8L: as R45 on sheet USB2.0_INTERFACE; Supplier 1: Avnet; Manufacturer Part Number: RC0402FR-076K8L; RoHS: Yes; Category: Chip SMD Resistors; Stock 1: 290000; Pricing 1: 10000=0.00085 (USD); Case/Package: 0402; Number of Pins: 2; Case Code (Imperial): 0402; Case Code (Metric): 1005; Size Code: 0402; Min Operating Temperature: -55°C; Max Operating Temperature: 155°C; Packaging: Tape and Reel; Tolerance: 1%; Voltage Rating (DC): 50V; Package Quantity: 1; Termination: SMD/SMT; Resistor Type: Thick Film; Number of Terminations: 2; Max Power Dissipation: 63mW; Features: Moisture Resistant; Series: RC; Construction: Rectangular; Resistance Tolerance: 1%; Technology: THICK FILM; Length: 0.039inch; Width: 0.02inch; Height: 0.016inch; Depth: 0.5mm; Reach SVHC Compliant: Yes; Military Standard: Not; Lead Free: Lead Free; RoHS Compliant: Yes; ComponentLink1URL: https://datasheet.ciiva.com/11819/0900766b80c66297-11819535.pdf?src-supplier=RSComponents; ComponentLink1Description: https://datasheet.ciiva.com/11819/0900766b80c66297-11819535.pdf?src-supplier=RSComponents; ComponentLink2URL: https://datasheet.ciiva.com/2453/pyu-r-int-thick-7-2453500.pdf?src-supplier=Digi-Key; ComponentLink2Description: https://datasheet.ciiva.com/2453/pyu-r-int-thick-7-2453500.pdf?src-supplier=Digi-Key; ComponentLink3URL: https://datasheet.ciiva.com/2453/pyu-r-int-thick-7-2453501.pdf?src-supplier=Digi-Key; ComponentLink3Description: https://datasheet.ciiva.com/2453/pyu-r-int-thick-7-2453501.pdf?src-supplier=Digi-Key; ComponentLink4URL: https://datasheet.ciiva.com/2453/pyu-r-int-thick-7-2453499.pdf?src-supplier=Digi-Key; ComponentLink4Description: https://datasheet.ciiva.com/2453/pyu-r-int-thick-7-2453499.pdf?src-supplier=Digi-Key; ComponentLink5URL: https://datasheet.ciiva.com/12668/pyu-rc0402-51-rohs-l-6-r-12668201.pdf?src-supplier=Mouser; ComponentLink5Description: https://datasheet.ciiva.com/12668/pyu-rc0402-51-rohs-l-6-r-12668201.pdf?src-supplier=Mouser; ComponentLink6URL: https://datasheet.ciiva.com/7850/1018594-7850078.pdf?src-supplier=Element14; ComponentLink6Description: https://datasheet.ciiva.com/7850/1018594-7850078.pdf?src-supplier=Element14; ComponentLink7URL: https://datasheet.ciiva.com/7850/1018594-7850079.pdf?src-supplier=Element14; ComponentLink7Description: https://datasheet.ciiva.com/7850/1018594-7850079.pdf?src-supplier=Element14; ComponentLink8URL: https://datasheet.ciiva.com/16741/pyu-rc0402-51-rohs-l-6-r-16741018.pdf?src-supplier=Future+Electronics; ComponentLink8Description: https://datasheet.ciiva.com/16741/pyu-rc0402-51-rohs-l-6-r-16741018.pdf?src-supplier=Future+Electronics; Supplier Part Number 1: RC0402FR-076K8L; LCSC Part Number: C93940
R33 R37 = RC0402FR-0710KL: as R46 on sheet USB2.0_INTERFACE; Manufacturer Part Number: RC0402FR-0710KL; RoHS: Yes; Category: Chip SMD Resistors; Case/Package: 0402; Case Code (Imperial): 0402; Case Code (Metric): 1005; Min Operating Temperature: -55°C; Max Operating Temperature: 155°C; Features: Moisture Resistant; Packaging: Tape and Reel; Tolerance: 1%; Number of Terminations: 2; Series: RC; RoHS Compliant: Yes; ComponentLink1URL: https://datasheet.ciiva.com/7660/38568-7660787.pdf?src-supplier=Element14; ComponentLink1Description: https://datasheet.ciiva.com/7660/38568-7660787.pdf?src-supplier=Element14; Supplier 1: Mouser; Stock 1: 18648329; Pricing 1: 1=0.10000, 10=0.01400, 50=0.01400, 100=0.00500, 1000=0.00300, 10000=0.00200 (USD); Number of Pins: 2; Resistor Type: Thick Film; Voltage Rating: 50V; Termination: SMD/SMT; Resistance Tolerance: 1%; Construction: Rectangular; Length: 1mm; Width: 0.5mm; Height: 0.32mm; Depth: 0.5mm; Lead Pitch: 0.2mm; REACH SVHC: No SVHC; Lead Free: Lead Free; Military Standard: Not; ComponentLink2URL: https://datasheet.ciiva.com/7849/1686128-7849814.pdf?src-supplier=Element14; ComponentLink2Description: https://datasheet.ciiva.com/7849/1686128-7849814.pdf?src-supplier=Element14; ComponentLink3URL: https://datasheet.ciiva.com/7983/1018594-7983486.pdf?src-supplier=Element14; ComponentLink3Description: https://datasheet.ciiva.com/7983/1018594-7983486.pdf?src-supplier=Element14; ComponentLink4URL: https://datasheet.ciiva.com/22747/1018594-22747512.pdf?src-supplier=Element14; ComponentLink4Description: https://datasheet.ciiva.com/22747/1018594-22747512.pdf?src-supplier=Element14; ComponentLink5URL: https://datasheet.ciiva.com/12667/pyu-rc0402-51-rohs-l-6-r-12667067.pdf?src-supplier=Mouser; ComponentLink5Description: https://datasheet.ciiva.com/12667/pyu-rc0402-51-rohs-l-6-r-12667067.pdf?src-supplier=Mouser; ComponentLink6URL: https://datasheet.ciiva.com/7849/1784430-7849813.pdf?src-supplier=Element14; ComponentLink6Description: https://datasheet.ciiva.com/7849/1784430-7849813.pdf?src-supplier=Element14; Supplier Part Number 1: 603-RC0402FR-0710KL; LCSC Part Number: C60490; Working Voltage: 50V; ComponentLink7URL: https://datasheet.ciiva.com/7849/1784430-7849815.pdf?src-supplier=Element14; ComponentLink7Description: https://datasheet.ciiva.com/7849/1784430-7849815.pdf?src-supplier=Element14
R34 = AF0402JR-071ML: as R47 on sheet USB2.0_INTERFACE; Manufacturer Part Number: AF0402JR-071ML; Case/Package: 0402; Min Operating Temperature: -55°C; Max Operating Temperature: 155°C; Packaging: Tape and Reel; Tolerance: 5%; Height: 0.015inch; ComponentLink1URL: https://www.yageo.com/upload/media/product/productsearch/datasheet/rchip/PYu-AF_51_RoHS_L_6.pdf?src-supplier=Digi-Key; ComponentLink1Description: https://www.yageo.com/upload/media/product/productsearch/datasheet/rchip/PYu-AF_51_RoHS_L_6.pdf?src-supplier=Digi-Key; Supplier 1: Digi-Key; Stock 1: 0; Pricing 1: 10000=0.00408 (USD); Length: 0.039inch; Width: 0.02inch; Supplier Part Number 1: AF0402JR-071ML-ND; LCSC Part Number: C144054; Resistor Type: Thick Film; Number of Terminations: 2; Features: Moisture Resistant,Anti-Sulfur; RoHS Compliant: Yes
TP4 TP5 = TEST POINT 0.5mm Dia: Test Point ON; Item Type: Test Point; Manufacturer Part Number: TEST POINT 0.5mm Dia
U6 U7 = SY6280AAC: as U8 on sheet USB2.0_INTERFACE; Supplier: Avnet; Supplier Part Number: SY6280AAC; Manufacturer Part Number: SY6280AAC; RoHS: No; Category: USB Interface ICs; Stock: 3000; LCSC Part Number: C55136